# EAGLE schematic Thermistor Hysteresis Example (EAGLE 9.5.2)
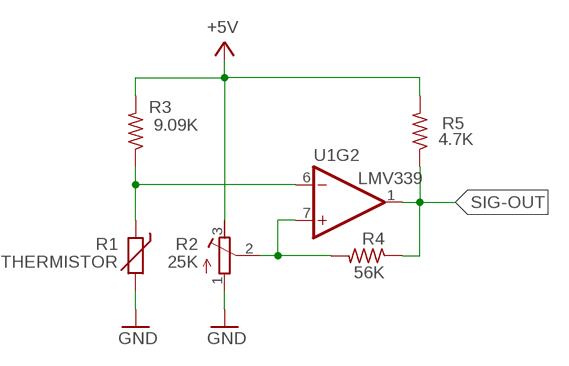
[diagram p0: schematic, sheet 1]

## Parts
R1  THERMISTOR  THERMISTOR-7,5  [R-7,5]
R2  25K  R-TRIMM3296Y  [RTRIM3296Y]
R3  9.09K  R-US_R0805  [R0805]
R4  56K  R-US_R0805  [R0805]
R5  4.7K  R-US_R0805  [R0805]
U1  LMV339  LM339SOIC-14  [SOIC127P599X175-14]

## Nets
+5V: R2.3(E) R3.2 R5.2
GND: R1.2 R2.1(A)
SIG-OUT: R4.1 R5.1 U1.1(OUT)
THER3-IN: R1.1 R3.1 U1.6(-IN)
TRIM3: R2.2(S) R4.2 U1.7(+IN)
Unconnected: U1.2(OUT) U1.3(P$V+) U1.4(-IN) U1.5(+IN) U1.8(-IN) U1.9(+IN) U1.10(-IN) U1.11(+IN) U1.12(P$V-) U1.13(OUT) U1.14(OUT)

## Library data of the parts
R1 = varistor:THERMISTOR: THERMISTOR
R2 = AUmlib:R-TRIMM: Trimm resistor; SPICEMODEL: X; SPICEPREFIXL: POT
R3-R5 = AUmlib:R-US_: RESISTOR, American symbol; SPICEPREFIX: R
U1 = AUmlib:LM339: Quad Comparator - LM339PWR Based on information from the SLCS006N datasheet from TI (www.ti.com). Created by nick@scantool.net, 2008. Updated 2016. SparkFun Products SparkFun OBD-II UART <https://www.sparkfun.com/products/9555> (WIG-09555) SparkFun Car Diagnostics Kit <https://www.sparkfun.com/products/10769> (RTL-10769)